# EAGLE design iuhr (EAGLE 6.6.0)
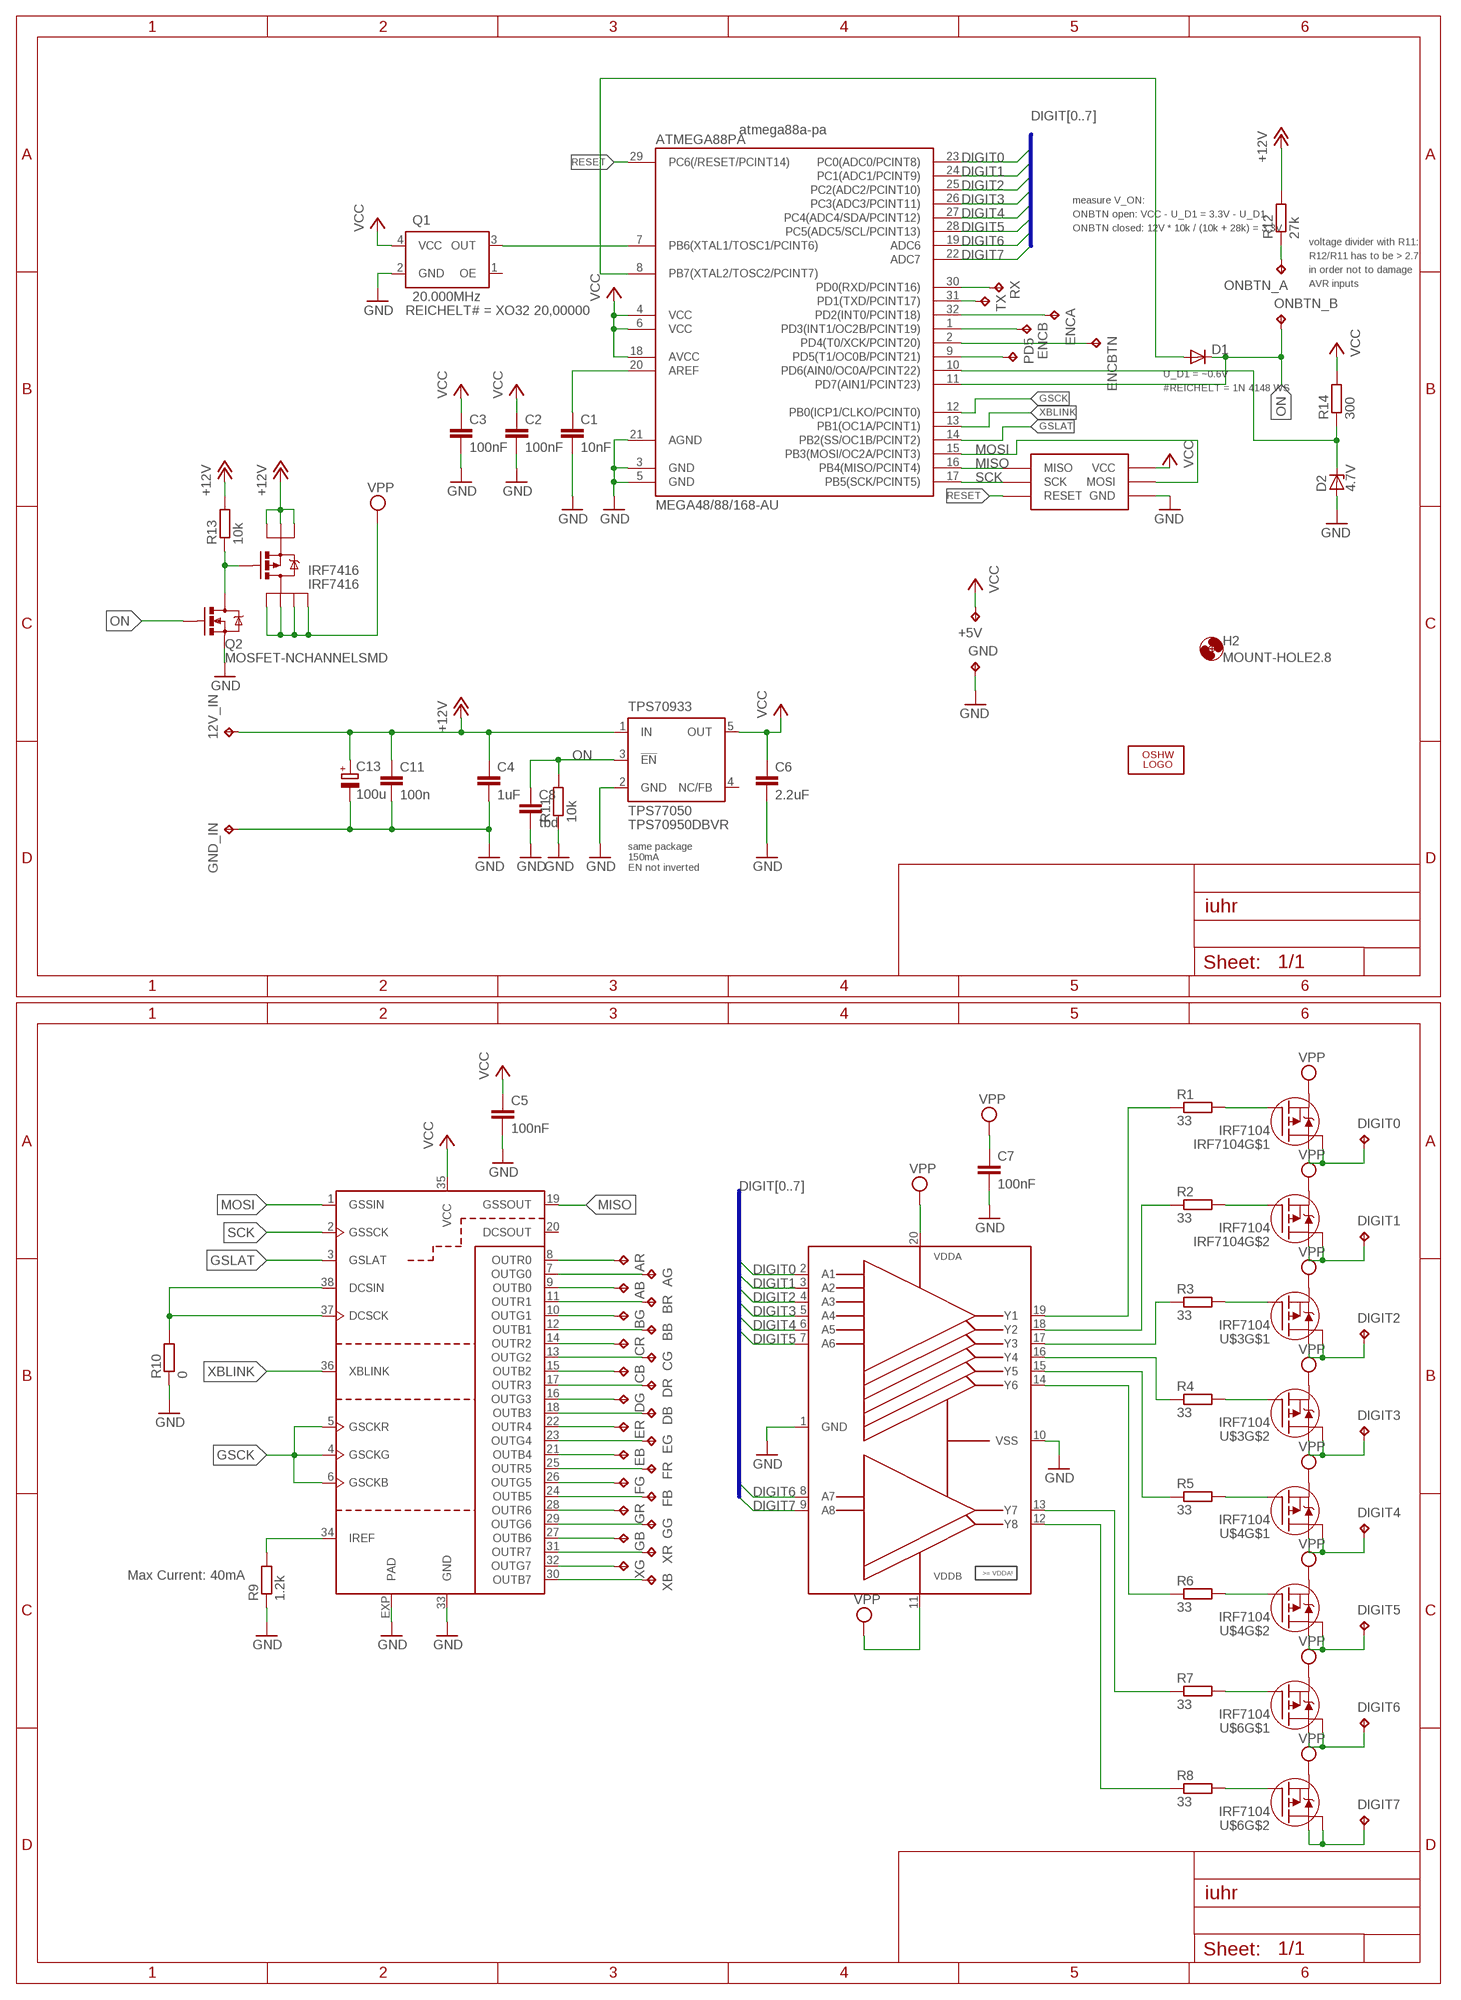
[diagram p0: schematic, sheet 1]

## Parts
12V_IN  TPTP20SQ  [TP20SQ]
+5V  TPTP15SQ  [TP15SQ]
AB  TPTP15SQ  [TP15SQ]
ADG3123  ADG3123BRUZ  [TSSOP20]
AG  TPTP15SQ  [TP15SQ]
AR  TPTP15SQ  [TP15SQ]
ATMEGA88PA  MEGA48/88/168-AU  [TQFP32-08]
BB  TPTP15SQ  [TP15SQ]
BG  TPTP15SQ  [TP15SQ]
BR  TPTP15SQ  [TP15SQ]
C1  10nF  C-EUC0603  [C0603]
C2  100nF  C-EUC0603  [C0603]
C3  100nF  C-EUC0603  [C0603]
C4  1uF  C-EUC0805  [C0805]
C5  100nF  C-EUC0603  [C0603]
C6  2.2uF  C-EUC0805  [C0805]
C7  100nF  C-EUC0603  [C0603]
C8  tbd  C-EUC0603  [C0603]
C11  100n  C-EUC0603  [C0603]
C13  100u  CPOL-EUE  [PANASONIC_E]
CB  TPTP15SQ  [TP15SQ]
CG  TPTP15SQ  [TP15SQ]
CR  TPTP15SQ  [TP15SQ]
D1  DIODE-SOD323-R  [SOD323-R]
D2  4.7V  ZENER-DIODESOT23  [SOT23]
DB  TPTP15SQ  [TP15SQ]
DG  TPTP15SQ  [TP15SQ]
DIGIT0  TPTP20SQ  [TP20SQ]
DIGIT1  TPTP20SQ  [TP20SQ]
DIGIT2  TPTP20SQ  [TP20SQ]
DIGIT3  TPTP20SQ  [TP20SQ]
DIGIT4  TPTP20SQ  [TP20SQ]
DIGIT5  TPTP20SQ  [TP20SQ]
DIGIT6  TPTP20SQ  [TP20SQ]
DIGIT7  TPTP20SQ  [TP20SQ]
DR  TPTP15SQ  [TP15SQ]
EB  TPTP15SQ  [TP15SQ]
EG  TPTP15SQ  [TP15SQ]
ENCA  TPTP15SQ  [TP15SQ]
ENCB  TPTP15SQ  [TP15SQ]
ENCBTN  TPTP15SQ  [TP15SQ]
ER  TPTP15SQ  [TP15SQ]
FB  TPTP15SQ  [TP15SQ]
FG  TPTP15SQ  [TP15SQ]
FR  TPTP15SQ  [TP15SQ]
GB  TPTP15SQ  [TP15SQ]
GG  TPTP15SQ  [TP15SQ]
GND  TPTP15SQ  [TP15SQ]
GND_IN  TPTP20SQ  [TP20SQ]
GR  TPTP15SQ  [TP15SQ]
H2  MOUNT-HOLE2.8  [2,8]
IRF7104  IRF7104  [SO8-2]
IRF7416  IRF7416  [SO8-2]
LOGO1  OSHW_LOGO_8MILX0200-NT  [OSHW_8X200_NOTEXT]
ONBTN_A  TPTP15SQ  [TP15SQ]
ONBTN_B  TPTP15SQ  [TP15SQ]
PD5  TPTP15SQ  [TP15SQ]
Q1  20.000MHz  XO32  [XO32]
Q2  MOSFET-NCHANNELSMD  [SOT23-3]
R1  33  R-EU_R0603  [R0603]
R2  33  R-EU_R0603  [R0603]
R3  33  R-EU_R0603  [R0603]
R4  33  R-EU_R0603  [R0603]
R5  33  R-EU_R0603  [R0603]
R6  33  R-EU_R0603  [R0603]
R7  33  R-EU_R0603  [R0603]
R8  33  R-EU_R0603  [R0603]
R9  1.2k  R-EU_R0603  [R0603]
R10  0  R-EU_R0603  [R0603]
R11  10k  R-EU_R0603  [R0603]
R12  27k  R-EU_R0603  [R0603]
R13  10k  R-EU_R0603  [R0603]
R14  300  R-EU_R0603  [R0603]
RX  TPTP15SQ  [TP15SQ]
TLC5951  TLC5951  [HTSSOP38DAP]
TPS70933  TPS77050  [SOT23-DBV]
TX  TPTP15SQ  [TP15SQ]
U$3  IRF7104  [SO8-2]
U$4  IRF7104  [SO8-2]
U$5  ISP_SPECIALS  [ISP_RM2_00_STRAIGHT]
U$6  IRF7104  [SO8-2]
XB  TPTP15SQ  [TP15SQ]
XG  TPTP15SQ  [TP15SQ]
XR  TPTP15SQ  [TP15SQ]

## Nets
+12V: 12V_IN.TP C4.1 C11.1 C13.+ IRF7416.1(S) IRF7416.2(S1) IRF7416.3(S2) R12.2 R13.2 TPS70933.1(IN)
CLK_STM: ATMEGA88PA.7(PB6(XTAL1/TOSC1/PCINT6)) Q1.3(OUT)
DIGIT0: ADG3123.2(A1) ATMEGA88PA.23(PC0(ADC0/PCINT8))
DIGIT1: ADG3123.3(A2) ATMEGA88PA.24(PC1(ADC1/PCINT9))
DIGIT2: ADG3123.4(A3) ATMEGA88PA.25(PC2(ADC2/PCINT10))
DIGIT3: ADG3123.5(A4) ATMEGA88PA.26(PC3(ADC3/PCINT11))
DIGIT4: ADG3123.6(A5) ATMEGA88PA.27(PC4(ADC4/SDA/PCINT12))
DIGIT5: ADG3123.7(A6) ATMEGA88PA.28(PC5(ADC5/SCL/PCINT13))
DIGIT6: ADG3123.8(A7) ATMEGA88PA.19(ADC6)
DIGIT7: ADG3123.9(A8) ATMEGA88PA.22(ADC7)
GND: ADG3123.1(GND) ADG3123.10(VSS) ATMEGA88PA.3(GND) ATMEGA88PA.5(GND) ATMEGA88PA.21(AGND) C1.2 C2.2 C3.2 C4.2 C5.2 C6.2 C7.2 C8.2 C11.2 C13.- D2.1(A) GND.TP GND_IN.TP Q1.2(GND) Q2.2(S) R9.1 R10.1 R11.1 TLC5951.33(GND) TLC5951.EXP(PAD) TPS70933.2(GND) U$5.VCC(GND)
GSCK: ATMEGA88PA.12(PB0(ICP1/CLKO/PCINT0)) TLC5951.4(GSCKG) TLC5951.5(GSCKR) TLC5951.6(GSCKB)
GSLAT: ATMEGA88PA.14(PB2(SS/OC1B/PCINT2)) TLC5951.3(GSLAT)
MISO: ATMEGA88PA.16(PB4(MISO/PCINT4)) TLC5951.19(GSSOUT) U$5.RESET(MISO)
MOSI: ATMEGA88PA.15(PB3(MOSI/OC2A/PCINT3)) TLC5951.1(GSSIN) U$5.MOSI
N$1: AR.TP TLC5951.8(OUTR0)
N$2: ATMEGA88PA.20(AREF) C1.1
N$3: AG.TP TLC5951.7(OUTG0)
N$4: AB.TP TLC5951.9(OUTB0)
N$5: BR.TP TLC5951.11(OUTR1)
N$6: BG.TP TLC5951.10(OUTG1)
N$7: ATMEGA88PA.30(PD0(RXD/PCINT16)) RX.TP
N$8: BB.TP TLC5951.12(OUTB1)
N$9: CR.TP TLC5951.14(OUTR2)
N$10: CG.TP TLC5951.13(OUTG2)
N$11: CB.TP TLC5951.15(OUTB2)
N$12: ATMEGA88PA.31(PD1(TXD/PCINT17)) TX.TP
N$13: DR.TP TLC5951.17(OUTR3)
N$14: DG.TP TLC5951.16(OUTG3)
N$15: DB.TP TLC5951.18(OUTB3)
N$16: ER.TP TLC5951.22(OUTR4)
N$17: EG.TP TLC5951.23(OUTG4)
N$18: EB.TP TLC5951.21(OUTB4)
N$19: FR.TP TLC5951.25(OUTR5)
N$20: FG.TP TLC5951.26(OUTG5)
N$21: ATMEGA88PA.32(PD2(INT0/PCINT18)) ENCA.TP
N$22: FB.TP TLC5951.24(OUTB5)
N$23: GR.TP TLC5951.28(OUTR6)
N$24: GG.TP TLC5951.29(OUTG6)
N$25: GB.TP TLC5951.27(OUTB6)
N$26: TLC5951.31(OUTR7) XR.TP
N$27: TLC5951.32(OUTG7) XG.TP
N$28: TLC5951.30(OUTB7) XB.TP
N$29: DIGIT0.TP IRF7104.7(D) IRF7104.8(D)
N$30: DIGIT1.TP IRF7104.5(D) IRF7104.6(D)
N$31: IRF7104.2(G) R1.2
N$32: IRF7104.4(G) R2.2
N$33: ADG3123.19(Y1) R1.1
N$34: DIGIT6.TP U$6.7(D) U$6.8(D)
N$35: DIGIT2.TP U$3.7(D) U$3.8(D)
N$36: DIGIT3.TP U$3.5(D) U$3.6(D)
N$37: R3.2 U$3.2(G)
N$38: R4.2 U$3.4(G)
N$39: ADG3123.17(Y3) R3.1
N$40: ADG3123.16(Y4) R4.1
N$41: DIGIT4.TP U$4.7(D) U$4.8(D)
N$42: DIGIT5.TP U$4.5(D) U$4.6(D)
N$43: R5.2 U$4.2(G)
N$44: R6.2 U$4.4(G)
N$45: ADG3123.15(Y5) R5.1
N$46: ADG3123.14(Y6) R6.1
N$47: ADG3123.18(Y2) R2.1
N$48: DIGIT7.TP U$6.5(D) U$6.6(D)
N$49: R7.2 U$6.2(G)
N$50: R8.2 U$6.4(G)
N$51: ADG3123.13(Y7) R7.1
N$52: ADG3123.12(Y8) R8.1
N$53: ATMEGA88PA.1(PD3(INT1/OC2B/PCINT19)) ENCB.TP
N$54: ATMEGA88PA.2(PD4(T0/XCK/PCINT20)) ENCBTN.TP
N$55: R9.2 TLC5951.34(IREF)
N$56: ATMEGA88PA.9(PD5(T1/OC0B/PCINT21)) PD5.TP
N$57: ATMEGA88PA.10(PD6(AIN0/OC0A/PCINT22)) D2.3(C) R14.1
N$58: ATMEGA88PA.8(PB7(XTAL2/TOSC2/PCINT7)) D1.A
N$59: ONBTN_A.TP R12.1
N$60: R10.2 TLC5951.37(DCSCK) TLC5951.38(DCSIN)
N$61: IRF7416.4(G) Q2.3(D) R13.1
ON: ATMEGA88PA.11(PD7(AIN1/PCINT23)) C8.1 D1.C ONBTN_B.TP Q2.1(G) R11.2 TPS70933.3(!EN)
RESET: ATMEGA88PA.29(PC6(/RESET/PCINT14)) U$5.MISO(RESET)
SCK: ATMEGA88PA.17(PB5(SCK/PCINT5)) TLC5951.2(GSSCK) U$5.SCK
VCC: +5V.TP ATMEGA88PA.4(VCC) ATMEGA88PA.6(VCC) ATMEGA88PA.18(AVCC) C2.1 C3.1 C5.1 C6.1 Q1.4(VCC) R14.2 TLC5951.35(VCC) TPS70933.5(OUT) U$5.GND(VCC)
VPP: ADG3123.11(VDDB) ADG3123.20(VDDA) C7.1 IRF7104.1(S) IRF7104.3(S) IRF7416.5(D3) IRF7416.6(D2) IRF7416.7(D1) IRF7416.8(D) U$3.1(S) U$3.3(S) U$4.1(S) U$4.3(S) U$6.1(S) U$6.3(S)
XBLINK: ATMEGA88PA.13(PB1(OC1A/PCINT1)) TLC5951.36(XBLINK)
Unconnected: Q1.1(OE) TLC5951.20(DCSOUT) TPS70933.4(NC/FB)

## Buses
DIGIT[0..7]

## Notes on the sheet
- atmega88a-pa
- measure V_ON:
- ONBTN open: VCC - U_D1 = 3.3V - U_D1
- ONBTN closed: 12V * 10k / (10k + 28k) = 3.3V
- voltage divider with R11:
- R12/R11 has to be > 2.7
- in order not to damage
- AVR inputs
- TPS70950DBVR
- same package
  150mA
  EN not inverted
- Max Current: 40mA

## Library data of the parts
12V_IN +5V AB AG AR BB BG BR CB CG CR DB DG DIGIT0 DIGIT1-DIGIT7 DR EB EG ENCA ENCB ENCBTN ER FB FG FR GB GG GND GND_IN GR ONBTN_A ONBTN_B PD5 RX TX XB XG XR = testpad:TP: Test pad
ADG3123 = iuhr:ADG3123
ATMEGA88PA = avr-7:MEGA48/88/168
C1-C8 C11 = resistor:C-EU: CAPACITOR, European symbol
C13 = resistor:CPOL-EU: POLARIZED CAPACITOR, European symbol
D1 = diode:DIODE-: DIODE; #REICHELT: 1N 4148 WS; IDENTIFIER: 1N4148-WS; U_D1: ~0.6V
D2 = diode:ZENER-DIODE: Z-Diode
H2 = holes:MOUNT-HOLE: MOUNTING HOLE with drill center marker
IRF7104 U$3 U$4 U$6 = irf-2:IRF7104: HEXFET® Power MOSFET Adavanced Process Technology Ultra Low On-Resistance Dual P-Channel MOSFET Surface Mount Available in Tape & Reel Dynamic dv/dt Rating Fast Switching Please connect both Drain-Pins of each FET for thermal Reasons! (Pin 5 with Pin 6, 7 with 8)
IRF7416 = ShortCircuitRobotics:IRF7416
LOGO1 = ea:OSHW_LOGO_8MIL
Q1 = rca_sontiges:XO: XO91 Series Oscillators Frequency Range 500 kHz to 125 MHz Supply voltage range 1.8, 2.5, 3.3 or 5.0 Volts Gibt es in der 3,3V Version bei Reichelt (XO91 #Wert) Datenblatt: http://www.reichelt.de/?;ACTION=7;LA=6;OPEN=0;INDEX=0;FILENAME=B400%252FXO91.pdf XO53 Series Oscillators Frequency Range 2.5 MHz to 125 MHz Supply voltage range 1.8, 2.5, 3.3 Volts Gibt es in der 3,3V Version bei Reichelt (XO53 #Wert) XO32 Series Oscillators Frequency Range 8 MHz to 50 MHz Supply voltage range 1.8, 2.5, 3.3 Volts Gibt es in der 3,3V Version bei Reichelt (XO32 #Wert); REICHELT#: XO32 20,00000
Q2 = SparkFun:MOSFET-NCHANNEL
R1-R14 = resistor:R-EU_: RESISTOR, European symbol
TLC5951 = iuhr:TLC5951
TPS70933 = texas:TPS770*: ULTRALOW-POWER 50-mA LOW-DROPOUT LINEAR REGULATORS 50-mA Low-Dropout Regulator Source: http://focus.ti.com/lit/ds/symlink/tps77001.pdf; MF: TEXAS INSTRUMENT CONNECTORS; MPN: TPS77050DBVT; OC_FARNELL: 1412883; OC_NEWARK: 77C1189
U$5 = bookla:ISP_SPECIAL

## Board
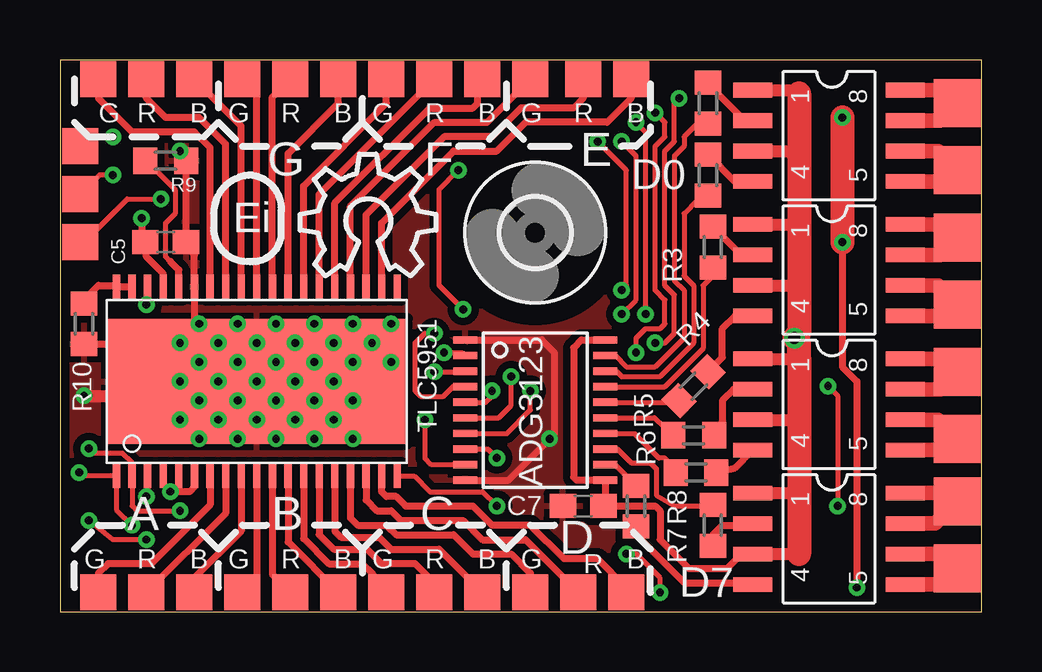
[diagram p1: board, top side]
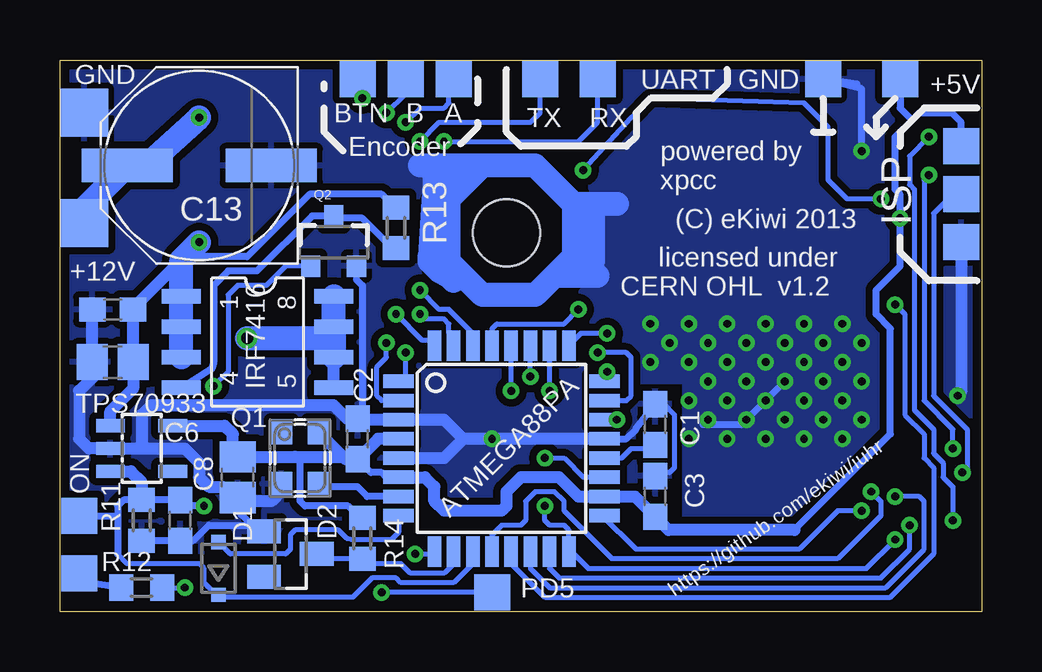
[diagram p2: board, bottom side, seen from below]

Size 38.4 x 23 mm. Coordinates in mm from the lower left corner, seen from the top.
Outline: 0,0 38.4,0 38.4,23 0,23 0,0
Copper layers (1*16): Top 0.0356mm / dielectric 1.5011mm / Bottom 0.0356mm
Design rules "LaenPCBOrder *": minimum track width 6mil, minimum drill 13mil, track to track 6mil, track to pad 6mil, pad to pad 6mil, via to via 6mil, smd to smd 0mil, copper to edge 15mil, drill to drill 6mil, minimum pad ring 7mil, minimum via ring 7mil, stop-mask expansion 3mil, vias tented up to drill 0.4mm, thermal gap 10mil

### Footprints (pad centres in the part's own frame; a part is rotated, then mirrored left to right if it is on the bottom)
TP20SQ = smd 2 x 2: TP 0,0
TP15SQ = smd 1.5 x 1.5: TP 0,0
TSSOP20 = smd 0.305 x 0.991: 1 -2.925,-2.918; 2 -2.275,-2.918; 3 -1.625,-2.918; 4 -0.975,-2.918; 5 -0.325,-2.918; 6 0.325,-2.918; 7 0.975,-2.918; 8 1.625,-2.918; 9 2.275,-2.918; 10 2.925,-2.918; 11 2.925,2.918; 12 2.275,2.918; 13 1.625,2.918; 14 0.975,2.918; 15 0.325,2.918; 16 -0.325,2.918; 17 -0.975,2.918; 18 -1.625,2.918; 19 -2.275,2.918; 20 -2.925,2.918
TQFP32-08 = smd 1.27 x 0.559: 1 -4.293,2.8; 2 -4.293,2; 3 -4.293,1.2; 4 -4.293,0.4; 5 -4.293,-0.4; 6 -4.293,-1.2; 7 -4.293,-2; 8 -4.293,-2.8; 17 4.293,-2.8; 18 4.293,-2; 19 4.293,-1.2; 20 4.293,-0.4; 21 4.293,0.4; 22 4.293,1.2; 23 4.293,2; 24 4.293,2.8 | smd 0.559 x 1.27: 9 -2.8,-4.293; 10 -2,-4.293; 11 -1.2,-4.293; 12 -0.4,-4.293; 13 0.4,-4.293; 14 1.2,-4.293; 15 2,-4.293; 16 2.8,-4.293; 25 2.8,4.293; 26 2,4.293; 27 1.2,4.293; 28 0.4,4.293; 29 -0.4,4.293; 30 -1.2,4.293; 31 -2,4.293; 32 -2.8,4.293
C0603 = smd 1.1 x 1: 1 -0.85,0; 2 0.85,0
C0805 = smd 1.3 x 1.5: 1 -0.85,0; 2 0.85,0
PANASONIC_E = smd 3.8 x 1.4: + 3,0; - -3,0
SOD323-R = smd 0.6 x 0.6: A 1.1,0; C -1.1,0
SOT23 = smd 1 x 1.4: 1 -0.95,-1.1; 2 0.95,-1.1; 3 0,1.1
2,8 = hole 2.8: 0,0
SO8-2 = smd 0.61 x 1.626: 1 -2.54,-2.54; 2 -1.27,-2.54; 3 0,-2.54; 4 1.27,-2.54; 5 1.27,3.81; 6 0,3.81; 7 -1.27,3.81; 8 -2.54,3.81
XO32 = smd 1 x 0.9: 1 -1.075,-0.775; 2 1.075,-0.775; 3 1.075,0.775; 4 -1.075,0.775
SOT23-3 = smd 0.8 x 0.9: 1 -0.95,-1; 2 0.95,-1; 3 0,1.1
R0603 = smd 1 x 1.1: 1 -0.85,0; 2 0.85,0
HTSSOP38DAP = smd 0.3 x 1: 1 -5.85,-3.95; 2 -5.2,-3.95; 3 -4.55,-3.95; 4 -3.9,-3.95; 5 -3.25,-3.95; 6 -2.6,-3.95; 7 -1.95,-3.95; 8 -1.3,-3.95; 9 -0.65,-3.95; 10 0,-3.95; 11 0.65,-3.95; 12 1.3,-3.95; 13 1.95,-3.95; 14 2.6,-3.95; 15 3.25,-3.95; 16 3.9,-3.95; 17 4.55,-3.95; 18 5.2,-3.95; 19 5.85,-3.95; 20 5.85,3.95; 21 5.2,3.95; 22 4.55,3.95; 23 3.9,3.95; 24 3.25,3.95; 25 2.6,3.95; 26 1.95,3.95; 27 1.3,3.95; 28 0.65,3.95; 29 0,3.95; 30 -0.65,3.95; 31 -1.3,3.95; 32 -1.95,3.95; 33 -2.6,3.95; 34 -3.25,3.95; 35 -3.9,3.95; 36 -4.55,3.95; 37 -5.2,3.95; 38 -5.85,3.95 | smd 12.5 x 5.2: EXP 0,0
SOT23-DBV = smd 0.55 x 1.2: 1 -0.95,-1.3; 2 0,-1.3; 3 0.95,-1.3; 4 0.95,1.3; 5 -0.95,1.3
ISP_RM2_00_STRAIGHT = smd 1.5 x 1.5 bottom: GND 2,-0.85; MOSI 0,-0.85; VCC -2,-0.85 | smd 1.5 x 1.5: MISO -2,-0.85; RESET 2,-0.85; SCK 0,-0.85

### Placement (x,y rotation side)
12V_IN  37.4,16.2 0 bottom
+5V  3.4,22.2 0 bottom
AB  5.6,0.8 0 top
ADG3123  19.8,8.4 270 top
AG  1.6,0.8 0 top
AR  3.6,0.8 0 top
ATMEGA88PA  20,6.8 0 bottom
BB  11.6,0.8 0 top
BG  7.6,0.8 0 top
BR  9.6,0.8 0 top
C1  13.6,7.8 90 bottom
C2  26,7.2 90 bottom
C3  13.6,4.8 90 bottom
C4  36.2,10.4 180 bottom
C5  4.4,15.4 0 top
C6  31,5.6 270 bottom
C7  21.8,4.4 180 top
C8  33.4,3.8 270 bottom
C11  36.2,12.6 180 bottom
C13  32.6,18.6 180 bottom
CB  17.6,0.8 0 top
CG  13.6,0.8 0 top
CR  15.6,0.8 0 top
D1  31.8,1.8 90 bottom
D2  28.8,2.4 270 bottom
DB  23.6,0.8 0 top
DG  19.6,0.8 0 top
DIGIT0  37.4,21.2 270 top
DIGIT1  37.4,18.4 270 top
DIGIT2  37.4,15.6 270 top
DIGIT3  37.4,12.8 270 top
DIGIT4  37.4,10 270 top
DIGIT5  37.4,7.2 270 top
DIGIT6  37.4,4.6 270 top
DIGIT7  37.4,1.8 270 top
DR  21.6,0.8 0 top
EB  23.8,22.2 0 top
EG  19.6,22.2 0 top
ENCA  22,22.2 0 bottom
ENCB  24,22.2 0 bottom
ENCBTN  26,22.2 0 bottom
ER  21.8,22.2 0 top
FB  17.6,22.2 0 top
FG  13.6,22.2 0 top
FR  15.6,22.2 0 top
GB  11.6,22.2 0 top
GG  7.6,22.2 0 top
GND  6.6,22.2 0 bottom
GND_IN  37.4,20.8 0 bottom
GR  9.6,22.2 0 top
H2  19.8,15.8 0 top
IRF7104  31.4,19.2 270 top
IRF7416  30.8,10.6 270 bottom
LOGO1  10,14 0 top
ONBTN_A  37.6,1.6 270 bottom
ONBTN_B  37.6,4 0 bottom
PD5  20.4,0.8 0 bottom
Q1  28.4,6.4 270 bottom
Q2  27,15.4 0 bottom
R1  27,21.2 90 top
R2  27,18.2 90 top
R3  27.2,15.2 90 top
R4  26.4,9.4 45 top
R5  26.4,7.35 0 top
R6  26.5,5.8 0 top
R7  27.2,3.6 270 top
R8  24,4.4 270 top
R9  4.4,18.8 180 top
R10  1,12 90 top
R11  35,3.8 90 bottom
R12  35,1 0 bottom
R13  24.4,16 90 bottom
R14  25.8,3.05 90 bottom
RX  16,22.2 0 bottom
TLC5951  8.2,9.6 0 top
TPS70933  35,6.8 270 bottom
TX  18.4,22.2 0 bottom
U$3  31.4,13.6 270 top
U$4  31.4,8 270 top
U$5  0,17.4 90 top
U$6  31.4,2.4 270 top
XB  5.6,22.2 0 top
XG  1.6,22.2 0 top
XR  3.6,22.2 0 top

### Tracks (layer width: path | path; a pad name or v marks a point on that pad's centre or on a via)
+12V  (via drill 0.33)
  Top 0.3: v32.6,15.4 32.6,10.2 33.2,9.6 v33.2,1
  Top 1: v32.6,20.6 v32.6,15.4
  Bottom 0.2: R12.2 v33.2,1
  Bottom 0.3: 33.34,14.66 33.2,14.8 30.6,14.8 28,17.4 25,17.4 24.45,16.85 R13.2
  Bottom 0.5: TPS70933.1 36.3,8.35 35.35,9.3 C4.1 C11.1 35.35,12.65 33.34,14.66
  Bottom 1: IRF7416.3 IRF7416.2 IRF7416.1 33.34,14.66 v32.6,15.4 | 12V_IN.TP 37.4,16.8 C13.+ 34.8,18.6 v32.6,20.6
CLK_STM
  Bottom 0.3: ATMEGA88PA.7 25.6,4.8 26,5.2 27.5,5.2 Q1.3
DIGIT0  (via drill 0.33)
  Top 0.2: v16,10.8 16.76,10.8 ADG3123.2
  Bottom 0.2: ATMEGA88PA.23 14.8,8.8 14.6,9 14.6,10.6 14.8,10.8 v16,10.8
DIGIT1  (via drill 0.33)
  Top 0.2: v15.6,10 16.86,10 ADG3123.3
  Bottom 0.2: ATMEGA88PA.24 15.4,9.6 15.4,9.8 v15.6,10
DIGIT2  (via drill 0.33)
  Top 0.2: v15.6,11.6 15.2,11.6 14.8,11.2 14.8,9.2 15.03,8.97 15.97,8.97 16.4,9.4 16.86,9.4 ADG3123.4
  Bottom 0.2: v15.6,11.6 16.69,11.6 ATMEGA88PA.25
DIGIT3  (via drill 0.33)
  Top 0.2: ADG3123.5 17.73,8.72 18,9 v18,9.2
  Bottom 0.2: v18,9.2 ATMEGA88PA.26
DIGIT4  (via drill 0.33)
  Top 0.2: ADG3123.6 18.27,8.07 18.8,8.6 v18.8,9.8
  Bottom 0.2: v18.8,9.8 ATMEGA88PA.27
DIGIT5  (via drill 0.33)
  Top 0.2: ADG3123.7 18.62,7.42 19.6,8.4 v19.6,9.2
  Bottom 0.2: v19.6,9.2 ATMEGA88PA.28
DIGIT6  (via drill 0.33)
  Top 0.2: ADG3123.8 17.82,6.78 v18.2,6.4
  Bottom 0.2: v18.2,6.4 17.4,6.4 16.6,5.6 ATMEGA88PA.19
DIGIT7  (via drill 0.33)
  Top 0.2: ADG3123.9 15.47,6.12 15.2,6.4 v15.2,8
  Bottom 0.2: ATMEGA88PA.22 v15.2,8
GND  (via drill 0.33)
  Top 0.3: ADG3123.1 20.07,11.32 20.6,10.8 20.6,7.4 v20.4,7.2 18.68,5.47 ADG3123.10 | R10.1 6.65,11.15 TLC5951.EXP 5.6,12.2 TLC5951.33 5.6,14.85 C5.2 R9.1 5.25,19.15 v5,19.2
  Top 0.5: v1,9 7.6,9 TLC5951.EXP
  Bottom 0.2: C1.2 13.25,8.65 12.8,8.2 12.8,6 13,5.8 13.45,5.8 C3.2
  Bottom 0.3: ATMEGA88PA.21 14.8,7.2 14.4,7.6 14.4,7.65 C1.2 | 11.6,7.8 10,7.8 TLC5951.EXP | 26.05,13.85 25.8,13.6 25.8,8.25 C2.2 | R11.1 C8.2 32.85,2.95 32.2,3.6 30.4,3.6 | 30.4,3.6 30.15,3.6 D2.1 | 30.85,4.6 30.85,4.05 30.4,3.6 | 5.2,22 GND.TP 5,21.8 v5,19.2
  Bottom 0.5: ATMEGA88PA.21 v20.4,7.2 21.6,7.2 | 21.6,7.2 22.4,8 ATMEGA88PA.3 25.95,8 C2.2 26.45,8.05 27,8.6 34.6,8.6 35,8.2 35,7 34.8,6.8 | ATMEGA88PA.5 22.4,6.4 21.6,7.2 | U$5.VCC 0.85,9.15 v1,9 | 13.35,8.6 C1.2 | C11.2 C4.2 37.05,9.75 37.6,9.2 37.6,7.2 37.2,6.8 TPS70933.2 34.8,6.8 | Q1.2 29.18,5.03 29.6,4.6 30.85,4.6 C6.2 31.65,5.2 32.2,5.2 32.6,5.6 32.6,6.2 33.2,6.8 34.8,6.8
  Bottom 1: 15.2,17 17,17 | 17,17 18.6,18.6 20.8,18.6 | 22,18.6 23.4,18.6 | 16,14 17.8,14 | 17.8,14 18.6,13.2 20.8,13.2 22.2,14.6 22.2,17.2 20.8,18.6 | 20.8,18.6 22,18.6 | 22,18.6 22.8,18 22.8,17.8 | 22.8,17.8 22.8,14.6 23,14.6 | 23,14.6 23,14.8 22.8,17.8 | 23,14.6 22.6,14.2 22.2,14 22,13.8 | 16.2,16.8 16.2,14.6 16.6,14.2 16.6,16.6 17,17 | 17,17 17,14.8 17.8,14
  other vias: 8.2,9.6 6.6,9.6 7.4,8.8 6.6,8 5.8,8.8 5,9.6 5,8 5.8,7.2 7.4,7.2 5.8,12 6.6,11.2 5,11.2 5.8,10.4 9,12 8.2,11.2 7.4,12 7.4,10.4 9,10.4 10.6,12 11.4,11.2 9.8,11.2 10.6,10.4 9.8,9.6 11.4,9.6 13.8,12 13,11.2 12.2,12 12.2,10.4 13.8,10.4 9,8.8 9.8,8 8.2,8 9,7.2 12.2,8.8 11.4,8 10.6,8.8 10.6,7.2 12.2,7.2
  pour Top (isolate 0.3): 0,23 38.4,23 38.4,0 0,0
  pour Bottom (isolate 0.3): 0,23 38.4,23 38.4,0 13,0 13,9.2 14.6,9.2 14.6,9.6 12.4,9.6 12.4,0 0,0
GSCK  (via drill 0.33)
  Top 0.3: TLC5951.6 5.6,5.2 5.4,5 v4.6,5 | v4.6,5 4.3,5.3 TLC5951.4 | TLC5951.5 4.95,5.05 v4.6,5
  Bottom 0.2: ATMEGA88PA.12 20.4,3.2 20,3.6 19.2,3.6 19,3.8 19,4.6 18.6,5 17.8,5 17.4,4.6 17.4,4.2 15.4,2.2 6,2.2 4.2,4 4.2,4.6 v4.6,5
GSLAT  (via drill 0.33)
  Top 0.2: TLC5951.3 3.65,4.95 v3.6,4.8
  Bottom 0.2: ATMEGA88PA.14 18.8,1.8 18,1 4,1 2.4,2.6 2.4,4.6 2.6,4.8 v3.6,4.8
MISO  (via drill 0.33)
  Top 0.2: U$5.RESET 1.2,19.8 v2.2,19.8 | 14.05,5.85 TLC5951.19 14.75,5.65 15.4,5 17.6,5 v18.2,4.4 18.4,4.2 | v3.6,3 2.2,3 v1.2,3.8
  Bottom 0.2: v2.2,19.8 3,19 3,17.8 2.8,17.6 2.8,8.4 2,7.6 2,6.6 1.6,6.2 1.6,5.6 1.2,5.2 v1.2,3.8 | v3.6,3 4.8,1.8 16.4,1.8 17.11,2.51 ATMEGA88PA.16 17.2,3.4 17.4,3.6 18,3.6 18.2,3.8 v18.2,4.4
MOSI  (via drill 0.33)
  Top 0.2: v0.8,5.8 0.95,5.65 TLC5951.1 2.35,4.25 v3,3.6
  Bottom 0.2: ATMEGA88PA.15 18,1.8 17.6,1.4 4.2,1.4 3,2.6 v3,3.6 | U$5.MOSI 1,17.6 2,16.6 2,9 0.6,7.6 0.6,6 v0.8,5.8
N$1
  Top 0.3: TLC5951.8 6.9,4.1 AR.TP
N$2
  Bottom 0.2: ATMEGA88PA.20 15,6.4 14.6,6.8 13.55,6.8 C1.1
N$3
  Top 0.3: TLC5951.7 6.25,4.45 3.8,2 2,2 1.6,1.6 AG.TP
N$4
  Top 0.3: TLC5951.9 7.55,3.35 5.6,1.4 AB.TP
N$5
  Top 0.3: TLC5951.11 8.85,1.55 BR.TP
N$6
  Top 0.3: TLC5951.10 8.2,1.4 BG.TP
N$7  (via drill 0.33)
  Top 0.2: v23.4,13.4 23.6,13.6 23.6,18.4 v22.4,19.6
  Bottom 0.2: ATMEGA88PA.30 21.2,11.6 22.2,12.6 22.6,12.6 v23.4,13.4 | v22.4,19.6 16.8,19.6 16,20.4 RX.TP
N$8
  Top 0.3: TLC5951.12 9.5,2.9 BB.TP
N$9
  Top 0.3: TLC5951.14 10.8,3.2 11.4,2.6 12.8,2.6 13.4,2 14.8,2 15.6,1.2 CR.TP
N$10
  Top 0.3: TLC5951.13 10.15,3.05 11.2,2 12.6,2 13,1.6 13.2,1.2 CG.TP
N$11
  Top 0.3: TLC5951.15 11.45,3.35 11.7,3.1 13.3,3.1 13.8,2.6 15.8,2.6 CB.TP
N$12  (via drill 0.33)
  Top 0.2: v23.4,12.4 24,13 24,19 v23.4,19.6
  Bottom 0.2: ATMEGA88PA.31 22,11.4 22.2,11.6 22.2,12 22.4,12.2 23.2,12.2 v23.4,12.4 | TX.TP 18.4,20.8 18.8,20.4 22.6,20.4 v23.4,19.6
N$13
  Top 0.2: TLC5951.17 12.75,5.25
  Top 0.3: 21.4,1 DR.TP 19.4,3 17.6,3 16.8,3.8 14.2,3.8 13.8,4.2 13.2,4.2 12.75,4.65 12.75,5.25
N$14
  Top 0.3: DG.TP 19.6,1.6 18.8,2.4 17.2,2.4 16.4,3.2 14,3.2 13.6,3.6 12.4,3.6 12.1,3.9 TLC5951.16
N$15
  Top 0.3: 13.4,5.4 TLC5951.18 13.4,5 13.6,4.8 14,4.8 14.4,4.4 17.2,4.4 18,3.6 19.6,3.6 21,2.2 22.4,2.2 23.6,1 DB.TP
N$16
  Top 0.3: ER.TP 21.8,21.4 21.4,21 19.2,21 18,19.8 16,19.8 12.75,16.55 TLC5951.22
N$17
  Top 0.3: 19.6,21.6 EG.TP 17.8,20.4 15.6,20.4 12.1,16.9 TLC5951.23
N$18
  Top 0.3: EB.TP 23.8,21.4 22.8,20.4 19.4,20.4 18.2,19.2 16.4,19.2 13.4,16.2 TLC5951.21
N$19
  Top 0.3: TLC5951.25 10.8,17.4 FR.TP
N$20
  Top 0.3: 14.2,22 FG.TP 13.6,21.2 10.15,17.75 TLC5951.26
N$21  (via drill 0.33)
  Top 0.2: v24.4,12.4 24.4,20 v24,20.4
  Bottom 0.2: 22.91,11.2 22.91,11.31 23.31,11.31 v24.4,12.4 | 21.4,21.6 ENCA.TP | 22.4,21.8 ENCA.TP | v24,20.4 23.4,21 22.4,21 22.2,21.2 22.2,22 ENCA.TP
  Bottom 0.3: ATMEGA88PA.32 22.91,11.2
N$22
  Top 0.3: 17.6,21.6 FB.TP | 17.2,21.8 FB.TP | FB.TP 17.4,22 17.4,21.2 17.2,21 15.4,21 11.45,17.05 TLC5951.24
N$23
  Top 0.3: TLC5951.28 8.85,21.45 GR.TP
N$24
  Top 0.3: 7.4,22 GG.TP 8.2,21.6 TLC5951.29
N$25
  Top 0.3: TLC5951.27 9.5,19.1 11.6,21.2 GB.TP
N$26
  Top 0.3: XR.TP 3.6,21.4 4.4,20.6 5.8,20.6 6.9,19.5 TLC5951.31
N$27
  Top 0.3: XG.TP 1.6,21.4 3,20 5.6,20 6.25,19.35 TLC5951.32
N$28
  Top 0.3: TLC5951.30 7.55,20.25 XB.TP
N$29
  Top 0.6: IRF7104.8 37.06,21.74 DIGIT0.TP 36.67,20.47 IRF7104.7
N$30
  Top 0.6: IRF7104.6 36.6,19.2 DIGIT1.TP 36.93,17.93 IRF7104.5
N$31
  Top 0.3: R1.2 27,22 28.53,20.47 IRF7104.2
N$32
  Top 0.3: R2.2 28.12,17.93 IRF7104.4
N$33
  Top 0.2: ADG3123.19 23.12,10.68 23.6,10.2 24.8,10.2 26,11.4 26,13.4 25.6,13.8 25.6,19 26,19.4 26,19.8 26.55,20.35 R1.1
N$34
  Top 0.6: U$6.8 37.06,4.94 DIGIT6.TP 36.47,3.67 U$6.7
N$35
  Top 0.6: U$3.8 36.86,16.14 DIGIT2.TP 36.67,14.87 U$3.7
N$36
  Top 0.6: U$3.6 36.6,13.6 DIGIT3.TP 36.93,12.33 U$3.5
N$37
  Top 0.3: U$3.2 28.18,14.87 28.18,15.07 R3.2
N$38
  Top 0.3: R4.2 27.6,10.6 27.6,11.8 28.13,12.33 U$3.4
N$39
  Top 0.2: ADG3123.17 25.2,9.38 26.8,10.97 26.8,13.6 27.2,14 R3.1
N$40
  Top 0.2: ADG3123.16 25.73,8.72 R4.1
N$41
  Top 0.6: U$4.8 36.86,10.54 DIGIT4.TP 36.67,9.27 U$4.7
N$42
  Top 0.6: U$4.6 36.6,8 DIGIT5.TP 36.93,6.73 U$4.5
N$43
  Top 0.3: U$4.2 28.07,9.27 27.6,8.8 27.6,7.95 R5.2
N$44
  Top 0.3: R6.2 28.13,6 U$4.4
N$45
  Top 0.2: ADG3123.15 24.77,8.07 R5.1
N$46
  Top 0.2: ADG3123.14 23.93,7.42 24.95,6.4 25.2,6.4 25.6,6 R6.1
N$47
  Top 0.2: ADG3123.18 23.18,10.03 23.4,9.8 25,9.8 26.4,11.2 26.4,13.6 26,14 26,16.6 26.55,17.15 R2.1
N$48
  Top 0.6: U$6.6 36.8,2.4 DIGIT7.TP 37.53,1.13 U$6.5
N$49
  Top 0.3: R7.2 27.2,3.2 27.6,3.6 28.79,3.6 U$6.2
N$50
  Top 0.3: R8.2 24,3.2 26,1.2 28.33,1.2 U$6.4
N$51
  Top 0.2: ADG3123.13 23.23,6.78 23.8,6.2 24.6,6.2 24.85,5.95 24.85,4.85 25.6,4.4 27.15,4.4 R7.1
N$52
  Top 0.2: ADG3123.12 23.12,6.12 R8.1
N$53  (via drill 0.33)
  Top 0.2: v24,10.8 24,11.4 24.4,11.8 25,11.8 25.2,12 25.2,13 24.8,13.4 24.8,19.4 25.2,19.8 25.2,20.4 v24.8,20.8
  Bottom 0.2: 24,9.6 ATMEGA88PA.1 24.4,9.6 | 23.8,9.6 24,9.6 | 24,9.6 v24,10.8 | v24.8,20.8 24,21.6 ENCB.TP
N$54  (via drill 0.33)
  Top 0.2: v24.8,11.2 25.2,11.2 25.6,11.6 25.6,13.2 25.2,13.6 25.2,19.2 25.6,19.6 25.6,21.2 v25.8,21.4
  Bottom 0.2: ATMEGA88PA.2 25,8.8 25.2,9 25.2,10.2 24.8,10.6 v24.8,11.2 | v25.8,21.4 25.8,21.6 26,21.8 ENCBTN.TP
N$55
  Top 0.2: 4.6,14.6 4.4,14.8 4.4,16.2 4.8,16.6 4.8,17.6 3.6,18.8 R9.2
  Top 0.3: TLC5951.34 4.95,14.25 4.6,14.6
N$56  (via drill 0.33)
  Top 0.2: v25,0.8 25,1.4 24,2.4 v23.6,2.4
  Bottom 0.2: PD5.TP v25,0.8 | v23.6,2.4 22.91,2.4 ATMEGA88PA.9
N$57
  Bottom 0.2: ATMEGA88PA.10 22,2 22.4,1.6 23.8,1.6 24.2,2 25.65,2 R14.1 27.5,2.2 D2.3
N$58
  Bottom 0.2: 24.2,3.91 ATMEGA88PA.8 24.29,3.31 24.6,3 26.25,3 26.45,3.05 26.8,3.4 28.6,3.4 28.8,3.2 28.8,2.6 29,2.4 31.3,2.4 D1.A
N$59
  Bottom 0.3: R12.1 37.2,1.2 ONBTN_A.TP
N$60
  Top 0.3: TLC5951.37 TLC5951.38 2.3,13.6 1.6,13.6 1,13 R10.2
N$61
  Bottom 0.3: IRF7416.4 32.07,10.13 32,10.4 32,13.6 31.4,14.2 30.2,14.2 27.9,16.5 Q2.3 26.9,16.4 25.8,16.4 24.55,15.15 R13.1
ON  (via drill 0.33)
  Top 0.2: v32,9.4 32.4,9 v32.4,4.4
  Bottom 0.2: Q2.1 29,14.4 29.8,13.6 31,13.6 31.4,13.2 31.4,10 v32,9.4 | ATMEGA88PA.11 21.2,2 22,1.2 24.2,1.2 24.4,1.4 25.4,1.4 26.2,0.6 31.5,0.6 | 31.5,0.6 D1.C | 31.5,0.6 32,0.8 32.4,1.2 32.4,1.8 32.6,2 35.6,2 36,2.4
  Bottom 0.3: 36,4 36,4.4 35.75,4.65 R11.2 C8.1 33.15,4.4 v32.4,4.4 | 36,4 36,2.4 | ONBTN_B.TP 36,4
  Bottom 0.5: TPS70933.3 35.45,5.85 35,5.4 R11.2
RESET  (via drill 0.33)
  Top 0.2: 1.2,16 0.85,15.65 U$5.MISO 1,15.4 2.8,17.2 v4.2,17.2 | v16.8,12.6 15.8,13.6 15.8,17.6 v16.6,18.4
  Bottom 0.2: ATMEGA88PA.29 20.4,11.8 20.2,12 17.4,12 v16.8,12.6 | v16.6,18.4 14.6,20.6 13.8,21.4 7.4,21.2 6.4,20.2 6.4,18 5.6,17.2 v4.2,17.2
SCK  (via drill 0.33)
  Top 0.2: v2.2,18.2 1.65,18.2 U$5.SCK | v5,4.2 3.2,4.2 3,4.4 TLC5951.2 3,6.2 2.6,6.6 1.4,6.6 v1.2,6.8
  Bottom 0.2: v2.2,18.2 2.4,18 2.4,8.8 1.2,7.6 v1.2,6.8 | 15.2,4 ATMEGA88PA.17 15.8,4 14.4,2.6 7.6,2.6 6,4.2 v5,4.2
VCC  (via drill 0.33)
  Top 0.3: TLC5951.35 4.3,14.1 3.6,14.8 3.6,15.15 C5.1 3.4,15.55 v3.4,16.4
  Bottom 0.2: R14.2 25.85,3.85 25.95,3.95
  Bottom 0.3: U$5.GND 0.85,20.4 1.25,20.8 2.6,20.8 2.9,20.5 | 2.9,20.5 3.6,19.8 3.6,17.6 3.4,17.4 v3.4,16.4 3.4,14.4 4.4,13.4 4.4,12.4 3.8,11.8 3.8,7.4 7.8,3.4 | 25.95,3.95 26.4,4.4 28.2,4.4 28.4,4.6 28.4,6.25 28.6,6.45 | ATMEGA88PA.6 24.8,5.6 25,5.8 25.45,5.8 C2.1 | +5V.TP 3.4,21 2.9,20.5
  Bottom 0.5: ATMEGA88PA.6 23.2,5.6 22.8,5.2 22.8,4.6 22.4,4.2 20,4.2 19.8,4.4 19.8,5 19.2,5.6 17.6,5.6 16.8,4.8 ATMEGA88PA.18 14.45,4.8 C3.1 13.05,3.4 7.8,3.4 | ATMEGA88PA.4 25.15,7.2 C2.1 | C2.1 26.5,6.35 Q1.4 | C2.1 26.1,6.45 28.6,6.45 C6.1 31.2,6.8 31.2,7.4 31.55,7.75 TPS70933.5
VPP  (via drill 0.5)
  Top 0.2: 22.65,4.15 C7.1
  Top 0.3: 22.65,4.15 22.72,4.08 ADG3123.11 21.52,5.47 21.4,5.6 21.4,11 21.73,11.32 ADG3123.20 | C7.1 22.8,4.2 23,4.4 24.8,4.4 25,4.2 25,3 26.2,1.8 27.8,1.8 28.4,2.4 U$6.3
  Top 0.5: IRF7104.1 30.66,21.74 30.8,21.6 | IRF7104.3 30.6,19.2 30.8,19 | U$3.1 30.74,16.14 30.8,16.2 | U$3.3 30.8,13.6 | U$4.1 30.74,10.54 30.8,10.6 | U$4.3 30.8,8 | U$6.3 30.8,2.4 | U$6.1 30.74,4.94 30.8,5
  Top 1: 30.8,21.6 30.8,19 30.8,16.2 30.8,13.6 30.8,11.6 v30.6,11.4 30.8,11.2 30.8,10.6 30.8,8 30.8,5 30.8,2.4
  Bottom 0.5: IRF7416.5 IRF7416.6
  Bottom 1: IRF7416.7 IRF7416.8 | IRF7416.7 IRF7416.6 | v30.6,11.4 27.46,11.4 IRF7416.7
XBLINK  (via drill 0.33)
  Top 0.2: TLC5951.36 3.65,12.75 v3.6,12.8
  Bottom 0.2: ATMEGA88PA.13 19.6,2 18.2,0.6 3.8,0.6 2,2.4 2,6 2.4,6.4 2.4,7.4 3.2,8.2 3.2,12.4 v3.6,12.8

### Text on the board
tNames: G | R | B | G | R | G | B | G | R | F | B | G | R | E | B | D0 | Ei | A | B | C | G | R | B | G | R | B | G | R | B | G | D | R | B | D7
bNames: UART | GND | A | B | BTN | ISP | Encoder | powered by / xpcc | (C) eKiwi 2013 | licensed under / CERN OHL v1.2 | +12V | ON | https://github.com/ekiwi/iuhr